# Altium schematic sheet pcb_mathis.SchDoc
size A4
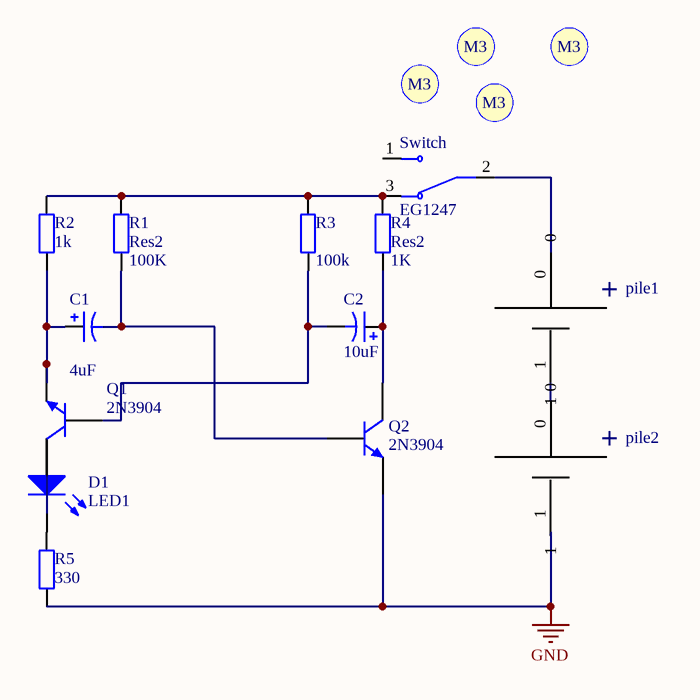
[diagram p0: pcb_mathis.SchDoc]

## Parts
C1  value 4uF  [Capacitor 1206]  (hidden comment: Cap Pol1)
C2  value 10uF  [Capacitor 1206]  (hidden comment: Cap Pol1)
D1  LED1  [LED-1]
pile1  (no value)  [PCBComponent_1]
pile2  (no value)  [PCBComponent_1]
Q1  2N3904  [TO-226-AA]
Q2  2N3904  [TO-226-AA]
R1  Res2  value 100K  [Resistor 1206]
R2  1k  [Resistor 1206]
R3  value 100k  [Resistor 1206]
R4  Res2  value 1K  [Resistor 1206]
R5  330  [Resistor 1206]
S1  Screw M3  [Screw M3]  (value not drawn)
S2  Screw M3  [Screw M3]  (value not drawn)
S3  Screw M3  [Screw M3]  (value not drawn)
S4  Screw M3  [Screw M3]  (value not drawn)
Switch  EG1247  [SW_EG1247]

## Nets
GND: Q2.3(E) R5.1
NetC1_1: C1.1 Q1.3(E) R2.1
NetC1_2: C1.2 Q2.2(B) R1.1
NetC2_1: C2.1 Q2.1(C) R4.1
NetC2_2: C2.2 Q1.2(B) R3.1
NetD1_2: D1.2(K) R5.2
NetR1_2: R1.2 R2.2 R3.2 R4.2 Switch.3

Not connected (* = marked no-connect by the designer): D1 1(A); pile1 0 1; pile2 0 1; Q1 1(C); Switch 1 2

## Notes on the sheet
- (in symbol Component_1) +
- (in symbol Screw M3) M3

## Library data of the parts
C1 C2 = Cap Pol1: Polarized Capacitor (Radial); Published: 8-Jun-2000; LatestRevisionDate: 17-Jul-2002; LatestRevisionNote: Re-released for DXP Platform.; PackageReference: RB7.6-15; Publisher: Altium Limited; PackageDescription: Polarized Capacitor (Radial); 2 Leads
D1 = LED1: Typical RED GaAs LED; Published: 8-Jun-2000; LatestRevisionDate: 08-Jul-2005; LatestRevisionNote: Mech Layer 1 removed.; PackageReference: LED-1; Publisher: Altium Limited; PackageDescription: LED; 2 Leads
pile1 pile2 = Component_1
Q1 Q2 = NPN: NPN Bipolar Transistor; Published: 8-Jun-2000; LatestRevisionDate: 17-Jul-2002; LatestRevisionNote: Re-released for DXP Platform.; PackageReference: TO-226-AA; Publisher: Altium Limited; PackageDescription: TO, Flat Index; 3 In-Line, Axial Leads; Body Dia. 4.8mm; Leads 0.55 x 0.51 mm (max); Code_JEDEC: TO-226-AA
R1-R5 = Res2: Resistor; Published: 8-Jun-2000; LatestRevisionDate: 17-Jul-2002; LatestRevisionNote: Re-released for DXP Platform.; PackageReference: AXIAL-0.4; Publisher: Altium Limited; PackageDescription: Axial Device, Thru-Hole; 2 Leads; 0.4 in Pin Spacing
Switch = EG1247: Slide Switch SPDT Through Hole, Right Angle; MF: E-Switch; Availability: In Stock; Value: *; Price: None; Check_prices: https://www.snapeda.com/parts/EG1247/E-Switch/view-part/?ref=eda; Purchase-URL: https://pricing.snapeda.com/search/part/EG1247/?ref=eda; SnapEDA_Link: https://www.snapeda.com/parts/EG1247/E-Switch/view-part/?ref=snap; MP: EG1247; Package: None